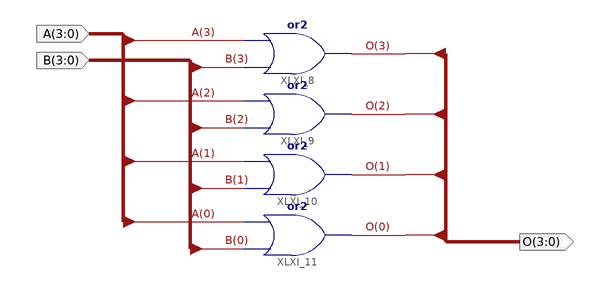
[diagram p0: schematic sheet 1]
// Xilinx ISE schematic myOr2b4.sch (kintex7) as structural Verilog: 4 symbols, 3 ports
module myOr2b4 (
  input  [3:0] A,
  input  [3:0] B,
  output [3:0] O
);

  or XLXI_8 (O[3], B[3], A[3]);
  or XLXI_9 (O[2], B[2], A[2]);
  or XLXI_10 (O[1], B[1], A[1]);
  or XLXI_11 (O[0], B[0], A[0]);
endmodule
